# Altium schematic sheet BUZZER.SchDoc
size A4; SheetNumber: 5; SheetTotal: 7
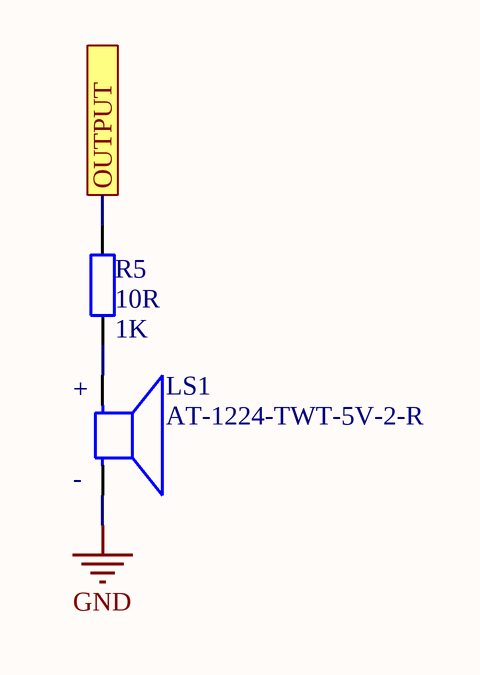
[diagram p0: BUZZER.SchDoc]

## Parts
LS1  AT-1224-TWT-5V-2-R  [XDCR_AT-1224-TWT-5V-2-R]
R5  10R  value 1K  [AXIAL-0.4]

## Ports
OUTPUT

## Nets
GND: LS1.N
OUTPUT: R5.2 ; port OUTPUT
NetLS1_P: LS1.P R5.1

## Notes on the sheet
- (in symbol AT-1224-TWT-5V-2-R) +; -

## Library data of the parts
LS1 = AT-1224-TWT-5V-2-R: AUDIO TRANSDUCER 12 VP-P 85 DB 2400 HZ; Package: None; Price: None; Value: *; MP: AT-1224-TWT-5V-2-R; Availability: Unavailable
R5 = Res2: Resistor; Published: 8-Jun-2000; LatestRevisionDate: 17-Jul-2002; LatestRevisionNote: Re-released for DXP Platform.; PackageReference: AXIAL-0.4; Publisher: Altium Limited; PackageDescription: Axial Device, Thru-Hole; 2 Leads; 0.4 in Pin Spacing